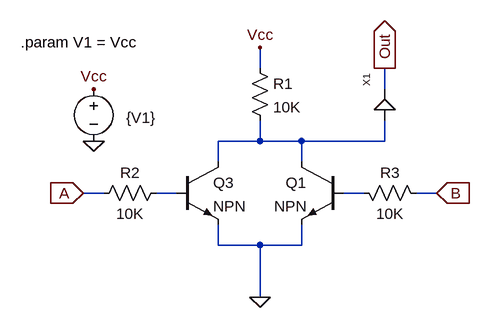
[diagram p0: schematic NOR.asc]
NOR.asc, the LTspice schematic file:
Version 4
SHEET 1 880 680
WIRE 240 -80 240 -112
WIRE 432 -48 432 -80
WIRE 240 32 240 0
WIRE 240 32 176 32
WIRE 304 32 240 32
WIRE 432 32 432 0
WIRE 432 32 304 32
WIRE 176 64 176 32
WIRE 304 64 304 32
WIRE 0 112 -32 112
WIRE 112 112 80 112
WIRE 400 112 368 112
WIRE 512 112 480 112
WIRE 176 192 176 160
WIRE 240 192 176 192
WIRE 304 192 304 160
WIRE 304 192 240 192
WIRE 240 272 240 192
FLAG -32 112 A
IOPIN -32 112 In
FLAG 512 112 B
IOPIN 512 112 In
FLAG 432 -80 Out
IOPIN 432 -80 Out
FLAG 240 -112 Vcc
FLAG 240 272 0
FLAG -16 32 0
FLAG -16 -48 Vcc
SYMBOL res 224 -96 R0
SYMATTR InstName R1
SYMATTR Value 10K
SYMATTR SpiceLine tol=1 pwr=0.1
SYMBOL res 96 96 R90
WINDOW 0 0 56 VBottom 2
WINDOW 3 32 56 VTop 2
SYMATTR InstName R2
SYMATTR Value 10K
SYMATTR SpiceLine tol=1 pwr=0.1
SYMBOL res 384 96 M90
WINDOW 0 0 56 VBottom 2
WINDOW 3 32 56 VTop 2
SYMATTR InstName R3
SYMATTR Value 10K
SYMATTR SpiceLine tol=1 pwr=0.1
SYMBOL Buffer 432 0 R270
SYMATTR InstName X1
SYMBOL npn 112 64 R0
SYMATTR InstName Q3
SYMBOL npn 368 64 M0
SYMATTR InstName Q1
SYMBOL voltage -16 -64 R0
WINDOW 0 24 16 Invisible 2
WINDOW 3 50 60 Left 2
SYMATTR InstName V1
SYMATTR Value {V1}
TEXT -128 -120 Left 2 !.param V1 = Vcc

The netlist it stands for:
* NOR.asc
R1 Vcc N001 10K tol=1 pwr=0.1
R2 N002 A 10K tol=1 pwr=0.1
R3 N003 B 10K tol=1 pwr=0.1
XX1 N001 Out Buffer Vcc = 5V  ; pins In Out
Q3 N001 N002 0 0 NPN
Q1 N001 N003 0 0 NPN
V1 Vcc 0 {V1}
.model NPN NPN
.model PNP PNP
.lib standard.bjt
.param V1 = Vcc
.backanno
.end